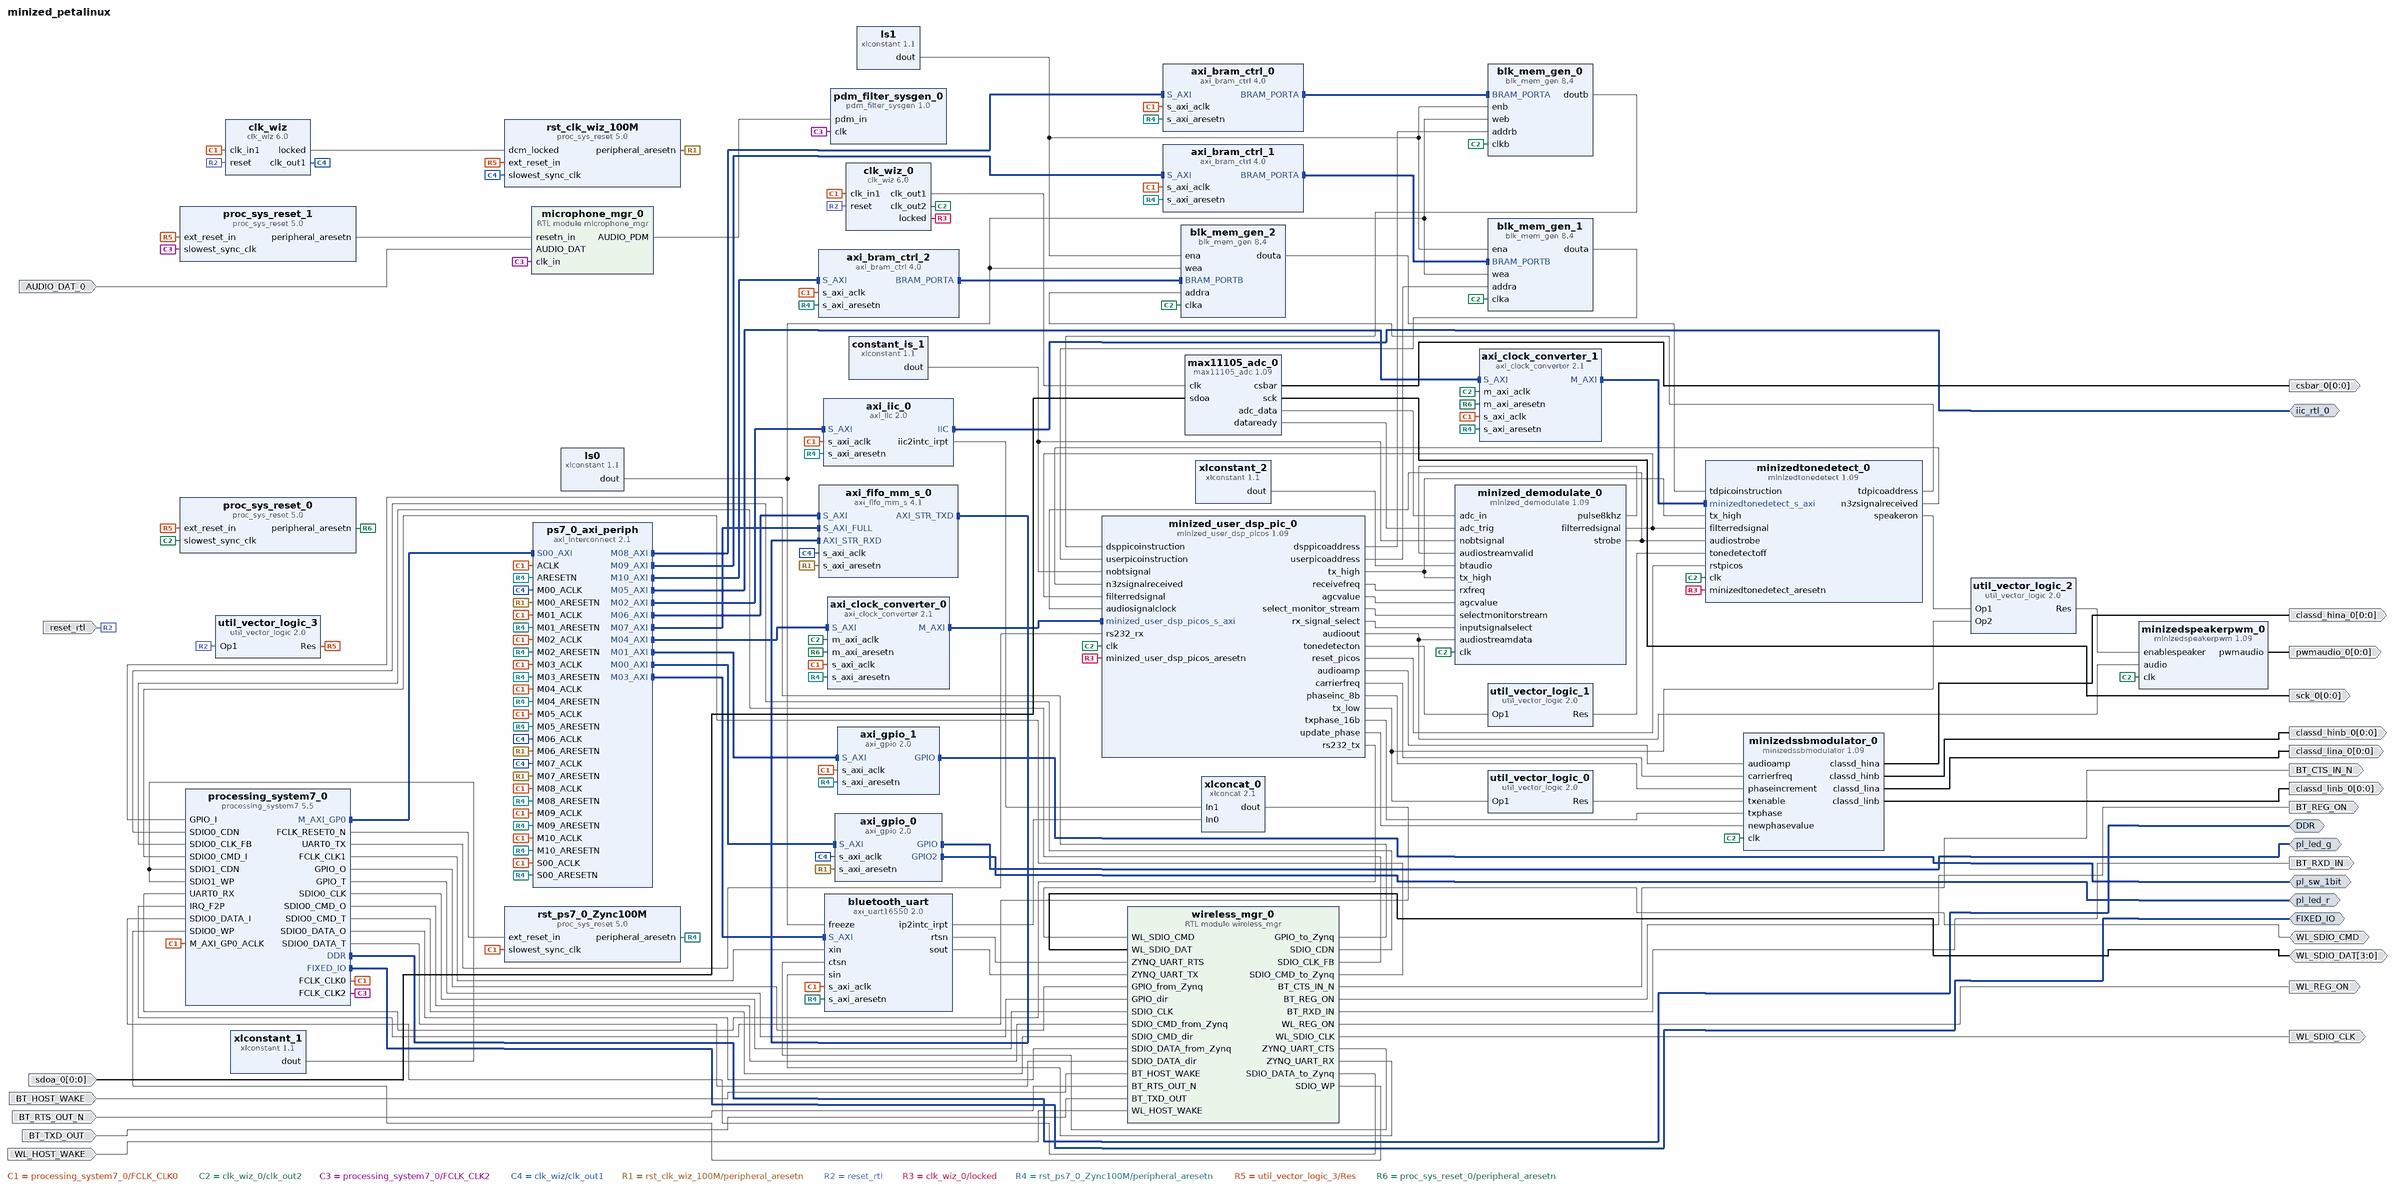
[diagram p0: block diagram of the top level]
# Vivado block design minized_petalinux, xc7z007sclg225-1, Vivado 2018.2.2
create_bd_design minized_petalinux

create_bd_intf_port -mode Master -vlnv xilinx.com:interface:ddrx_rtl:1.0 DDR
create_bd_intf_port -mode Master -vlnv xilinx.com:display_processing_system7:fixedio_rtl:1.0 FIXED_IO
create_bd_intf_port -mode Master -vlnv xilinx.com:interface:iic_rtl:1.0 iic_rtl_0
create_bd_intf_port -mode Master -vlnv xilinx.com:interface:gpio_rtl:1.0 pl_led_g
create_bd_intf_port -mode Master -vlnv xilinx.com:interface:gpio_rtl:1.0 pl_led_r
create_bd_intf_port -mode Master -vlnv xilinx.com:interface:gpio_rtl:1.0 pl_sw_1bit
create_bd_port -dir I BT_HOST_WAKE
create_bd_port -dir I BT_RTS_OUT_N
create_bd_port -dir I BT_TXD_OUT
create_bd_port -dir IO WL_SDIO_CMD
create_bd_port -dir IO -from 3 -to 0 WL_SDIO_DAT
create_bd_port -dir I WL_HOST_WAKE
create_bd_port -dir O BT_CTS_IN_N
create_bd_port -dir O BT_REG_ON
create_bd_port -dir O BT_RXD_IN
create_bd_port -dir O WL_REG_ON
create_bd_port -dir O -type clk WL_SDIO_CLK
create_bd_port -dir I -from 0 -to 0 -type data sdoa_0
set_property -dict [list \
  CONFIG.LAYERED_METADATA {xilinx.com:interface:datatypes:1.0 {DATA {datatype {name {attribs {resolve_type immediate dependency {} format string minimum {} maximum {}} value {}} bitwidth {attribs {resolve_type immediate dependency {} format long minimum {} maximum {}} value 1} bitoffset {attribs {resolve_type immediate dependency {} format long minimum {} maximum {}} value 0} real {fixed {fractwidth {attribs {resolve_type immediate dependency {} format long minimum {} maximum {}} value 0} signed {attribs {resolve_type immediate dependency {} format bool minimum {} maximum {}} value false}}}}}}} \
] [get_bd_ports sdoa_0]
create_bd_port -dir O -from 0 -to 0 -type data csbar_0
create_bd_port -dir O -from 0 -to 0 -type data sck_0
create_bd_port -dir O -from 0 -to 0 -type data pwmaudio_0
create_bd_port -dir O -from 0 -to 0 -type data classd_hina_0
create_bd_port -dir O -from 0 -to 0 -type data classd_lina_0
create_bd_port -dir O -from 0 -to 0 -type data classd_hinb_0
create_bd_port -dir O -from 0 -to 0 -type data classd_linb_0
create_bd_port -dir I AUDIO_DAT_0
create_bd_port -dir I -type rst reset_rtl
set_property -dict {CONFIG.POLARITY ACTIVE_HIGH} [get_bd_ports reset_rtl]

create_bd_cell -type ip -vlnv xilinx.com:ip:axi_gpio:2.0 axi_gpio_0
set_property -dict [list \
  CONFIG.C_GPIO_WIDTH 1 \
  CONFIG.C_GPIO2_WIDTH 1 \
  CONFIG.C_IS_DUAL 1 \
  CONFIG.C_ALL_INPUTS_2 0 \
  CONFIG.USE_BOARD_FLOW true \
  CONFIG.GPIO_BOARD_INTERFACE Custom \
  CONFIG.C_ALL_OUTPUTS 1 \
  CONFIG.C_ALL_OUTPUTS_2 1 \
] [get_bd_cells axi_gpio_0]
create_bd_cell -type ip -vlnv xilinx.com:ip:axi_gpio:2.0 axi_gpio_1
set_property -dict {CONFIG.USE_BOARD_FLOW true CONFIG.GPIO_BOARD_INTERFACE pl_sw_1bit} [get_bd_cells axi_gpio_1]
create_bd_cell -type ip -vlnv xilinx.com:ip:axi_iic:2.0 axi_iic_0
create_bd_cell -type ip -vlnv xilinx.com:ip:axi_uart16550:2.0 bluetooth_uart
set_property -dict [list \
  CONFIG.C_EXTERNAL_XIN_CLK_HZ 48000000 \
  CONFIG.C_EXTERNAL_XIN_CLK_HZ_d 48 \
  CONFIG.C_HAS_EXTERNAL_XIN 1 \
] [get_bd_cells bluetooth_uart]
create_bd_cell -type ip -vlnv xilinx.com:ip:processing_system7:5.5 processing_system7_0
set_property -dict [list \
  CONFIG.PCW_FCLK_CLK1_BUF TRUE \
  CONFIG.PCW_FCLK_CLK2_BUF TRUE \
  CONFIG.PCW_UIPARAM_DDR_FREQ_MHZ 533.333333 \
  CONFIG.PCW_APU_PERIPHERAL_FREQMHZ 666.666666 \
  CONFIG.PCW_QSPI_PERIPHERAL_FREQMHZ 120 \
  CONFIG.PCW_SDIO_PERIPHERAL_FREQMHZ 25 \
  CONFIG.PCW_UART_PERIPHERAL_FREQMHZ 100 \
  CONFIG.PCW_FPGA0_PERIPHERAL_FREQMHZ 100 \
  CONFIG.PCW_FPGA1_PERIPHERAL_FREQMHZ 48 \
  CONFIG.PCW_FPGA2_PERIPHERAL_FREQMHZ 160 \
  CONFIG.PCW_USE_FABRIC_INTERRUPT 1 \
  CONFIG.PCW_GPIO_EMIO_GPIO_WIDTH 4 \
  CONFIG.PCW_DQ_WIDTH 16 \
  CONFIG.PCW_DQS_WIDTH 2 \
  CONFIG.PCW_DM_WIDTH 2 \
  CONFIG.PCW_MIO_PRIMITIVE 32 \
  CONFIG.PCW_EN_CLK1_PORT 1 \
  CONFIG.PCW_EN_CLK2_PORT 1 \
  CONFIG.PCW_IRQ_F2P_INTR 1 \
  CONFIG.PCW_PRESET_BANK1_VOLTAGE {LVCMOS 3.3V} \
  CONFIG.PCW_UIPARAM_DDR_MEMORY_TYPE {DDR 3 (Low Voltage)} \
  CONFIG.PCW_UIPARAM_DDR_BUS_WIDTH {16 Bit} \
  CONFIG.PCW_UIPARAM_DDR_PARTNO {MT41K256M16 RE-125} \
  CONFIG.PCW_QSPI_PERIPHERAL_ENABLE 1 \
  CONFIG.PCW_QSPI_QSPI_IO {MIO 1 .. 6} \
  CONFIG.PCW_QSPI_GRP_SINGLE_SS_ENABLE 1 \
  CONFIG.PCW_QSPI_GRP_SINGLE_SS_IO {MIO 1 .. 6} \
  CONFIG.PCW_SINGLE_QSPI_DATA_MODE x4 \
  CONFIG.PCW_QSPI_GRP_FBCLK_ENABLE 1 \
  CONFIG.PCW_QSPI_GRP_FBCLK_IO {MIO 8} \
  CONFIG.PCW_ENET0_PERIPHERAL_ENABLE 0 \
  CONFIG.PCW_SD0_PERIPHERAL_ENABLE 1 \
  CONFIG.PCW_SD0_SD0_IO EMIO \
  CONFIG.PCW_SD1_PERIPHERAL_ENABLE 1 \
  CONFIG.PCW_SD1_SD1_IO {MIO 10 .. 15} \
  CONFIG.PCW_SD1_GRP_CD_ENABLE 1 \
  CONFIG.PCW_SD1_GRP_CD_IO EMIO \
  CONFIG.PCW_SD1_GRP_WP_ENABLE 1 \
  CONFIG.PCW_SD1_GRP_WP_IO EMIO \
  CONFIG.PCW_UART0_PERIPHERAL_ENABLE 1 \
  CONFIG.PCW_UART0_UART0_IO EMIO \
  CONFIG.PCW_UART0_GRP_FULL_ENABLE 1 \
  CONFIG.PCW_UART0_GRP_FULL_IO EMIO \
  CONFIG.PCW_UART1_PERIPHERAL_ENABLE 1 \
  CONFIG.PCW_UART1_UART1_IO {MIO 48 .. 49} \
  CONFIG.PCW_USB0_PERIPHERAL_ENABLE 1 \
  CONFIG.PCW_USB0_USB0_IO {MIO 28 .. 39} \
  CONFIG.PCW_USB_RESET_ENABLE 1 \
  CONFIG.PCW_USB_RESET_SELECT {Share reset pin} \
  CONFIG.PCW_USB0_RESET_ENABLE 1 \
  CONFIG.PCW_USB0_RESET_IO {MIO 7} \
  CONFIG.PCW_I2C_RESET_ENABLE 1 \
  CONFIG.PCW_GPIO_MIO_GPIO_ENABLE 1 \
  CONFIG.PCW_GPIO_MIO_GPIO_IO MIO \
  CONFIG.PCW_GPIO_EMIO_GPIO_ENABLE 1 \
  CONFIG.PCW_GPIO_EMIO_GPIO_IO 4 \
  CONFIG.PCW_FPGA_FCLK1_ENABLE 1 \
  CONFIG.PCW_FPGA_FCLK2_ENABLE 1 \
] [get_bd_cells processing_system7_0]
# 314 more settings of processing_system7_0 are not shown: defaults, MIO pin electricals, DDR timing, and values the tool derives
create_bd_cell -type ip -vlnv xilinx.com:ip:axi_interconnect:2.1 ps7_0_axi_periph
set_property -dict {CONFIG.NUM_MI 11} [get_bd_cells ps7_0_axi_periph]
create_bd_cell -type ip -vlnv xilinx.com:ip:xlconcat:2.1 xlconcat_0
set_property -dict {CONFIG.NUM_PORTS 2} [get_bd_cells xlconcat_0]
create_bd_cell -type ip -vlnv xilinx.com:ip:xlconstant:1.1 xlconstant_1
set_property -dict {CONFIG.CONST_VAL 0} [get_bd_cells xlconstant_1]
create_bd_cell -type module -reference wireless_mgr wireless_mgr_0
create_bd_cell -type ip -vlnv AssociationNicola:SysGen:minized_demodulate:1.09 minized_demodulate_0
create_bd_cell -type ip -vlnv AssociationNicola:SysGen:minizedspeakerpwm:1.09 minizedspeakerpwm_0
create_bd_cell -type ip -vlnv AssociationNicola:SysGen:minizedssbmodulator:1.09 minizedssbmodulator_0
create_bd_cell -type ip -vlnv AssociationNicola:SysGen:minizedtonedetect:1.09 minizedtonedetect_0
create_bd_cell -type ip -vlnv xilinx.com:ip:util_vector_logic:2.0 util_vector_logic_0
set_property -dict {CONFIG.C_SIZE 1 CONFIG.C_OPERATION not} [get_bd_cells util_vector_logic_0]
create_bd_cell -type ip -vlnv xilinx.com:ip:clk_wiz:6.0 clk_wiz_0
set_property -dict [list \
  CONFIG.PRIM_IN_FREQ 100 \
  CONFIG.CLKIN1_JITTER_PS 100.0 \
  CONFIG.CLKOUT2_USED true \
  CONFIG.CLKOUT3_USED false \
  CONFIG.NUM_OUT_CLKS 2 \
  CONFIG.CLKOUT1_REQUESTED_OUT_FREQ 131.072 \
  CONFIG.CLKOUT2_REQUESTED_OUT_FREQ 65.536 \
  CONFIG.MMCM_DIVCLK_DIVIDE 6 \
  CONFIG.MMCM_CLKFBOUT_MULT_F 51.125 \
  CONFIG.MMCM_CLKIN1_PERIOD 10.000 \
  CONFIG.MMCM_CLKIN2_PERIOD 10.000 \
  CONFIG.MMCM_CLKOUT0_DIVIDE_F 6.500 \
  CONFIG.MMCM_CLKOUT1_DIVIDE 13 \
  CONFIG.MMCM_CLKOUT2_DIVIDE 1 \
  CONFIG.CLKOUT1_JITTER 303.243 \
  CONFIG.CLKOUT1_PHASE_ERROR 386.312 \
  CONFIG.CLKOUT2_JITTER 334.225 \
  CONFIG.CLKOUT2_PHASE_ERROR 386.312 \
  CONFIG.CLKOUT3_JITTER 259.942 \
  CONFIG.CLKOUT3_PHASE_ERROR 297.965 \
] [get_bd_cells clk_wiz_0]
create_bd_cell -type ip -vlnv xilinx.com:ip:xlconstant:1.1 constant_is_1
create_bd_cell -type ip -vlnv xilinx.com:ip:xlconstant:1.1 xlconstant_2
set_property -dict {CONFIG.CONST_WIDTH 16 CONFIG.CONST_VAL 0} [get_bd_cells xlconstant_2]
create_bd_cell -type ip -vlnv xilinx.com:ip:util_vector_logic:2.0 util_vector_logic_1
set_property -dict {CONFIG.C_SIZE 1 CONFIG.C_OPERATION not} [get_bd_cells util_vector_logic_1]
create_bd_cell -type ip -vlnv xilinx.com:ip:util_vector_logic:2.0 util_vector_logic_2
set_property -dict {CONFIG.C_SIZE 1 CONFIG.C_OPERATION and} [get_bd_cells util_vector_logic_2]
create_bd_cell -type ip -vlnv AssociationNicola:SysGen:minized_user_dsp_picos:1.09 minized_user_dsp_pic_0
create_bd_cell -type ip -vlnv AssociationNicola:SysGen:max11105_adc:1.09 max11105_adc_0
create_bd_cell -type module -reference microphone_mgr microphone_mgr_0
create_bd_cell -type ip -vlnv Avnet_Inc:SysGen:pdm_filter_sysgen:1.0 pdm_filter_sysgen_0
create_bd_cell -type ip -vlnv xilinx.com:ip:axi_fifo_mm_s:4.1 axi_fifo_mm_s_0
set_property -dict {CONFIG.C_DATA_INTERFACE_TYPE 1 CONFIG.C_USE_TX_CTRL 0} [get_bd_cells axi_fifo_mm_s_0]
create_bd_cell -type ip -vlnv xilinx.com:ip:axi_bram_ctrl:4.0 axi_bram_ctrl_0
set_property -dict {CONFIG.SINGLE_PORT_BRAM 1} [get_bd_cells axi_bram_ctrl_0]
create_bd_cell -type ip -vlnv xilinx.com:ip:blk_mem_gen:8.4 blk_mem_gen_0
set_property -dict [list \
  CONFIG.Memory_Type True_Dual_Port_RAM \
  CONFIG.Enable_32bit_Address false \
  CONFIG.Use_Byte_Write_Enable false \
  CONFIG.Write_Depth_A 2048 \
  CONFIG.Enable_B Use_ENB_Pin \
  CONFIG.Register_PortA_Output_of_Memory_Primitives true \
  CONFIG.Register_PortB_Output_of_Memory_Primitives true \
  CONFIG.Load_Init_File false \
  CONFIG.Use_RSTA_Pin false \
  CONFIG.Use_RSTB_Pin false \
  CONFIG.Port_B_Clock 100 \
  CONFIG.Port_B_Write_Rate 50 \
  CONFIG.Port_B_Enable_Rate 100 \
  CONFIG.use_bram_block Stand_Alone \
] [get_bd_cells blk_mem_gen_0]
create_bd_cell -type ip -vlnv xilinx.com:ip:clk_wiz:6.0 clk_wiz
set_property -dict [list \
  CONFIG.PRIM_IN_FREQ 100 \
  CONFIG.CLKIN1_JITTER_PS 100.0 \
  CONFIG.MMCM_DIVCLK_DIVIDE 1 \
  CONFIG.MMCM_CLKFBOUT_MULT_F 10.000 \
  CONFIG.MMCM_CLKIN1_PERIOD 10.000 \
  CONFIG.MMCM_CLKIN2_PERIOD 10.000 \
  CONFIG.CLKOUT1_JITTER 130.958 \
  CONFIG.CLKOUT1_PHASE_ERROR 98.575 \
] [get_bd_cells clk_wiz]
create_bd_cell -type ip -vlnv xilinx.com:ip:proc_sys_reset:5.0 rst_clk_wiz_100M
create_bd_cell -type ip -vlnv xilinx.com:ip:proc_sys_reset:5.0 rst_ps7_0_Zync100M
create_bd_cell -type ip -vlnv xilinx.com:ip:axi_bram_ctrl:4.0 axi_bram_ctrl_1
set_property -dict {CONFIG.SINGLE_PORT_BRAM 1} [get_bd_cells axi_bram_ctrl_1]
create_bd_cell -type ip -vlnv xilinx.com:ip:axi_bram_ctrl:4.0 axi_bram_ctrl_2
set_property -dict {CONFIG.SINGLE_PORT_BRAM 1} [get_bd_cells axi_bram_ctrl_2]
create_bd_cell -type ip -vlnv xilinx.com:ip:xlconstant:1.1 Is1
create_bd_cell -type ip -vlnv xilinx.com:ip:xlconstant:1.1 Is0
set_property -dict {CONFIG.CONST_VAL 0} [get_bd_cells Is0]
create_bd_cell -type ip -vlnv xilinx.com:ip:blk_mem_gen:8.4 blk_mem_gen_1
set_property -dict [list \
  CONFIG.Memory_Type True_Dual_Port_RAM \
  CONFIG.Enable_32bit_Address false \
  CONFIG.Use_Byte_Write_Enable false \
  CONFIG.Write_Depth_A 2048 \
  CONFIG.Enable_B Use_ENB_Pin \
  CONFIG.Register_PortA_Output_of_Memory_Primitives true \
  CONFIG.Register_PortB_Output_of_Memory_Primitives true \
  CONFIG.Load_Init_File false \
  CONFIG.Use_RSTA_Pin false \
  CONFIG.Use_RSTB_Pin false \
  CONFIG.Port_B_Clock 100 \
  CONFIG.Port_B_Write_Rate 50 \
  CONFIG.Port_B_Enable_Rate 100 \
  CONFIG.use_bram_block Stand_Alone \
] [get_bd_cells blk_mem_gen_1]
create_bd_cell -type ip -vlnv xilinx.com:ip:blk_mem_gen:8.4 blk_mem_gen_2
set_property -dict [list \
  CONFIG.Memory_Type True_Dual_Port_RAM \
  CONFIG.Enable_32bit_Address false \
  CONFIG.Use_Byte_Write_Enable false \
  CONFIG.Write_Depth_A 2048 \
  CONFIG.Enable_B Use_ENB_Pin \
  CONFIG.Register_PortA_Output_of_Memory_Primitives true \
  CONFIG.Register_PortB_Output_of_Memory_Primitives true \
  CONFIG.Load_Init_File false \
  CONFIG.Use_RSTA_Pin false \
  CONFIG.Use_RSTB_Pin false \
  CONFIG.Port_B_Clock 100 \
  CONFIG.Port_B_Write_Rate 50 \
  CONFIG.Port_B_Enable_Rate 100 \
  CONFIG.use_bram_block Stand_Alone \
] [get_bd_cells blk_mem_gen_2]
create_bd_cell -type ip -vlnv xilinx.com:ip:axi_clock_converter:2.1 axi_clock_converter_0
create_bd_cell -type ip -vlnv xilinx.com:ip:axi_clock_converter:2.1 axi_clock_converter_1
create_bd_cell -type ip -vlnv xilinx.com:ip:proc_sys_reset:5.0 proc_sys_reset_1
create_bd_cell -type ip -vlnv xilinx.com:ip:util_vector_logic:2.0 util_vector_logic_3
set_property -dict {CONFIG.C_SIZE 1 CONFIG.C_OPERATION not} [get_bd_cells util_vector_logic_3]
create_bd_cell -type ip -vlnv xilinx.com:ip:proc_sys_reset:5.0 proc_sys_reset_0

# ---- connections ----

connect_bd_intf_net [get_bd_intf_pins processing_system7_0/M_AXI_GP0] [get_bd_intf_pins ps7_0_axi_periph/S00_AXI]
connect_bd_intf_net [get_bd_intf_pins axi_gpio_0/S_AXI] [get_bd_intf_pins ps7_0_axi_periph/M00_AXI]
connect_bd_intf_net [get_bd_intf_pins axi_gpio_1/S_AXI] [get_bd_intf_pins ps7_0_axi_periph/M01_AXI]
connect_bd_intf_net [get_bd_intf_pins axi_iic_0/S_AXI] [get_bd_intf_pins ps7_0_axi_periph/M02_AXI]
connect_bd_intf_net [get_bd_intf_pins bluetooth_uart/S_AXI] [get_bd_intf_pins ps7_0_axi_periph/M03_AXI]
connect_bd_intf_net [get_bd_intf_pins axi_fifo_mm_s_0/AXI_STR_TXD] [get_bd_intf_pins axi_fifo_mm_s_0/AXI_STR_RXD]
connect_bd_intf_net [get_bd_intf_pins ps7_0_axi_periph/M06_AXI] [get_bd_intf_pins axi_fifo_mm_s_0/S_AXI]
connect_bd_intf_net [get_bd_intf_pins ps7_0_axi_periph/M07_AXI] [get_bd_intf_pins axi_fifo_mm_s_0/S_AXI_FULL]
connect_bd_intf_net [get_bd_intf_pins ps7_0_axi_periph/M08_AXI] [get_bd_intf_pins axi_bram_ctrl_0/S_AXI]
connect_bd_intf_net [get_bd_intf_pins axi_bram_ctrl_1/BRAM_PORTA] [get_bd_intf_pins blk_mem_gen_1/BRAM_PORTB]
connect_bd_intf_net [get_bd_intf_pins axi_bram_ctrl_2/BRAM_PORTA] [get_bd_intf_pins blk_mem_gen_2/BRAM_PORTB]
connect_bd_intf_net [get_bd_intf_pins ps7_0_axi_periph/M09_AXI] [get_bd_intf_pins axi_bram_ctrl_1/S_AXI]
connect_bd_intf_net [get_bd_intf_pins ps7_0_axi_periph/M10_AXI] [get_bd_intf_pins axi_bram_ctrl_2/S_AXI]
connect_bd_intf_net [get_bd_intf_pins ps7_0_axi_periph/M04_AXI] [get_bd_intf_pins axi_clock_converter_0/S_AXI]
connect_bd_intf_net [get_bd_intf_pins axi_clock_converter_0/M_AXI] [get_bd_intf_pins minized_user_dsp_pic_0/minized_user_dsp_picos_s_axi]
connect_bd_intf_net [get_bd_intf_pins ps7_0_axi_periph/M05_AXI] [get_bd_intf_pins axi_clock_converter_1/S_AXI]
connect_bd_intf_net [get_bd_intf_pins axi_clock_converter_1/M_AXI] [get_bd_intf_pins minizedtonedetect_0/minizedtonedetect_s_axi]
connect_bd_intf_net [get_bd_intf_pins blk_mem_gen_0/BRAM_PORTA] [get_bd_intf_pins axi_bram_ctrl_0/BRAM_PORTA]
connect_bd_intf_net [get_bd_intf_ports DDR] [get_bd_intf_pins processing_system7_0/DDR]
connect_bd_intf_net [get_bd_intf_ports FIXED_IO] [get_bd_intf_pins processing_system7_0/FIXED_IO]
connect_bd_intf_net [get_bd_intf_ports iic_rtl_0] [get_bd_intf_pins axi_iic_0/IIC]
connect_bd_intf_net [get_bd_intf_ports pl_led_g] [get_bd_intf_pins axi_gpio_0/GPIO]
connect_bd_intf_net [get_bd_intf_ports pl_led_r] [get_bd_intf_pins axi_gpio_0/GPIO2]
connect_bd_intf_net [get_bd_intf_ports pl_sw_1bit] [get_bd_intf_pins axi_gpio_1/GPIO]
connect_bd_net [get_bd_ports BT_HOST_WAKE] [get_bd_pins wireless_mgr_0/BT_HOST_WAKE]
connect_bd_net [get_bd_ports BT_RTS_OUT_N] [get_bd_pins wireless_mgr_0/BT_RTS_OUT_N]
connect_bd_net [get_bd_ports BT_TXD_OUT] [get_bd_pins wireless_mgr_0/BT_TXD_OUT]
connect_bd_net [get_bd_ports WL_SDIO_CMD] [get_bd_pins wireless_mgr_0/WL_SDIO_CMD]
connect_bd_net [get_bd_ports WL_SDIO_DAT] [get_bd_pins wireless_mgr_0/WL_SDIO_DAT]
connect_bd_net [get_bd_ports WL_HOST_WAKE] [get_bd_pins wireless_mgr_0/WL_HOST_WAKE]
connect_bd_net [get_bd_pins axi_iic_0/iic2intc_irpt] [get_bd_pins xlconcat_0/In1]
connect_bd_net -net bluetooth_uart_INT [get_bd_pins bluetooth_uart/ip2intc_irpt] [get_bd_pins xlconcat_0/In0]
connect_bd_net [get_bd_pins processing_system7_0/FCLK_CLK1] [get_bd_pins bluetooth_uart/xin]
connect_bd_net [get_bd_pins processing_system7_0/FCLK_RESET0_N] [get_bd_pins rst_ps7_0_Zync100M/ext_reset_in]
connect_bd_net [get_bd_pins processing_system7_0/GPIO_O] [get_bd_pins wireless_mgr_0/GPIO_from_Zynq]
connect_bd_net [get_bd_pins processing_system7_0/GPIO_T] [get_bd_pins wireless_mgr_0/GPIO_dir]
connect_bd_net [get_bd_pins processing_system7_0/SDIO0_CLK] [get_bd_pins wireless_mgr_0/SDIO_CLK]
connect_bd_net [get_bd_pins processing_system7_0/SDIO0_CMD_O] [get_bd_pins wireless_mgr_0/SDIO_CMD_from_Zynq]
connect_bd_net [get_bd_pins processing_system7_0/SDIO0_CMD_T] [get_bd_pins wireless_mgr_0/SDIO_CMD_dir]
connect_bd_net [get_bd_pins processing_system7_0/SDIO0_DATA_O] [get_bd_pins wireless_mgr_0/SDIO_DATA_from_Zynq]
connect_bd_net [get_bd_pins processing_system7_0/SDIO0_DATA_T] [get_bd_pins wireless_mgr_0/SDIO_DATA_dir]
connect_bd_net [get_bd_pins wireless_mgr_0/BT_CTS_IN_N] [get_bd_ports BT_CTS_IN_N]
connect_bd_net [get_bd_pins wireless_mgr_0/BT_REG_ON] [get_bd_ports BT_REG_ON]
connect_bd_net [get_bd_pins wireless_mgr_0/BT_RXD_IN] [get_bd_ports BT_RXD_IN]
connect_bd_net [get_bd_pins wireless_mgr_0/GPIO_to_Zynq] [get_bd_pins processing_system7_0/GPIO_I]
connect_bd_net [get_bd_pins wireless_mgr_0/SDIO_CDN] [get_bd_pins processing_system7_0/SDIO0_CDN]
connect_bd_net [get_bd_pins wireless_mgr_0/SDIO_CLK_FB] [get_bd_pins processing_system7_0/SDIO0_CLK_FB]
connect_bd_net [get_bd_pins wireless_mgr_0/SDIO_CMD_to_Zynq] [get_bd_pins processing_system7_0/SDIO0_CMD_I]
connect_bd_net [get_bd_pins wireless_mgr_0/SDIO_DATA_to_Zynq] [get_bd_pins processing_system7_0/SDIO0_DATA_I]
connect_bd_net [get_bd_pins wireless_mgr_0/SDIO_WP] [get_bd_pins processing_system7_0/SDIO0_WP]
connect_bd_net -net wireless_mgr_0_UART_CTS [get_bd_pins wireless_mgr_0/ZYNQ_UART_CTS] [get_bd_pins bluetooth_uart/ctsn]
connect_bd_net -net wireless_mgr_0_UART_RTS [get_bd_pins bluetooth_uart/rtsn] [get_bd_pins wireless_mgr_0/ZYNQ_UART_RTS]
connect_bd_net -net wireless_mgr_0_UART_RX [get_bd_pins wireless_mgr_0/ZYNQ_UART_RX] [get_bd_pins bluetooth_uart/sin]
connect_bd_net -net wireless_mgr_0_UART_TX [get_bd_pins bluetooth_uart/sout] [get_bd_pins wireless_mgr_0/ZYNQ_UART_TX]
connect_bd_net [get_bd_pins wireless_mgr_0/WL_REG_ON] [get_bd_ports WL_REG_ON]
connect_bd_net [get_bd_pins wireless_mgr_0/WL_SDIO_CLK] [get_bd_ports WL_SDIO_CLK]
connect_bd_net [get_bd_pins xlconcat_0/dout] [get_bd_pins processing_system7_0/IRQ_F2P]
connect_bd_net [get_bd_pins xlconstant_1/dout] [get_bd_pins processing_system7_0/SDIO1_CDN] [get_bd_pins processing_system7_0/SDIO1_WP]
connect_bd_net [get_bd_pins processing_system7_0/UART0_TX] [get_bd_pins minized_user_dsp_pic_0/rs232_rx]
connect_bd_net [get_bd_pins minized_user_dsp_pic_0/rs232_tx] [get_bd_pins processing_system7_0/UART0_RX]
connect_bd_net [get_bd_pins minized_user_dsp_pic_0/audioamp] [get_bd_pins minizedssbmodulator_0/audioamp]
connect_bd_net [get_bd_pins minized_user_dsp_pic_0/carrierfreq] [get_bd_pins minizedssbmodulator_0/carrierfreq]
connect_bd_net [get_bd_pins minized_user_dsp_pic_0/phaseinc_8b] [get_bd_pins minizedssbmodulator_0/phaseincrement]
connect_bd_net [get_bd_pins minized_user_dsp_pic_0/txphase_16b] [get_bd_pins minizedssbmodulator_0/txphase]
connect_bd_net [get_bd_pins minized_user_dsp_pic_0/update_phase] [get_bd_pins minizedssbmodulator_0/newphasevalue]
connect_bd_net [get_bd_pins minized_user_dsp_pic_0/audioout] \
  [get_bd_pins minizedspeakerpwm_0/audio] [get_bd_pins minized_demodulate_0/audiostreamdata]
connect_bd_net [get_bd_pins minized_user_dsp_pic_0/tx_low] [get_bd_pins util_vector_logic_0/Op1] [get_bd_pins util_vector_logic_2/Op2]
connect_bd_net [get_bd_pins util_vector_logic_0/Res] [get_bd_pins minizedssbmodulator_0/txenable]
connect_bd_net [get_bd_pins minized_user_dsp_pic_0/receivefreq] [get_bd_pins minized_demodulate_0/rxfreq]
connect_bd_net [get_bd_pins minized_demodulate_0/filterredsignal] \
  [get_bd_pins minizedtonedetect_0/filterredsignal] [get_bd_pins minized_user_dsp_pic_0/filterredsignal]
connect_bd_net [get_bd_pins minized_user_dsp_pic_0/agcvalue] [get_bd_pins minized_demodulate_0/agcvalue]
connect_bd_net [get_bd_pins processing_system7_0/FCLK_CLK0] \
  [get_bd_pins clk_wiz_0/clk_in1] [get_bd_pins axi_iic_0/s_axi_aclk] [get_bd_pins axi_bram_ctrl_0/s_axi_aclk] \
  [get_bd_pins rst_ps7_0_Zync100M/slowest_sync_clk] [get_bd_pins clk_wiz/clk_in1] [get_bd_pins axi_bram_ctrl_1/s_axi_aclk] \
  [get_bd_pins axi_bram_ctrl_2/s_axi_aclk] [get_bd_pins axi_clock_converter_0/s_axi_aclk] \
  [get_bd_pins axi_clock_converter_1/s_axi_aclk] [get_bd_pins processing_system7_0/M_AXI_GP0_ACLK] \
  [get_bd_pins axi_gpio_1/s_axi_aclk] [get_bd_pins bluetooth_uart/s_axi_aclk] [get_bd_pins ps7_0_axi_periph/M02_ACLK] \
  [get_bd_pins ps7_0_axi_periph/ACLK] [get_bd_pins ps7_0_axi_periph/M04_ACLK] [get_bd_pins ps7_0_axi_periph/M05_ACLK] \
  [get_bd_pins ps7_0_axi_periph/M08_ACLK] [get_bd_pins ps7_0_axi_periph/M09_ACLK] [get_bd_pins ps7_0_axi_periph/M10_ACLK] \
  [get_bd_pins ps7_0_axi_periph/M01_ACLK] [get_bd_pins ps7_0_axi_periph/M03_ACLK] [get_bd_pins ps7_0_axi_periph/S00_ACLK]
connect_bd_net [get_bd_pins minized_demodulate_0/pulse8khz] [get_bd_pins minized_demodulate_0/audiostreamvalid]
connect_bd_net [get_bd_pins minized_demodulate_0/strobe] \
  [get_bd_pins minizedtonedetect_0/audiostrobe] [get_bd_pins minized_user_dsp_pic_0/audiosignalclock]
connect_bd_net [get_bd_pins xlconstant_2/dout] [get_bd_pins minized_demodulate_0/btaudio]
connect_bd_net -net xlconstant_0_dout [get_bd_pins constant_is_1/dout] \
  [get_bd_pins minized_demodulate_0/nobtsignal] [get_bd_pins minized_user_dsp_pic_0/nobtsignal]
connect_bd_net [get_bd_pins minized_user_dsp_pic_0/tx_high] [get_bd_pins minized_demodulate_0/tx_high] [get_bd_pins minizedtonedetect_0/tx_high]
connect_bd_net [get_bd_pins minized_user_dsp_pic_0/select_monitor_stream] [get_bd_pins minized_demodulate_0/selectmonitorstream]
connect_bd_net [get_bd_pins minized_user_dsp_pic_0/rx_signal_select] [get_bd_pins minized_demodulate_0/inputsignalselect]
connect_bd_net [get_bd_pins minized_user_dsp_pic_0/tonedetecton] [get_bd_pins util_vector_logic_1/Op1]
connect_bd_net [get_bd_pins util_vector_logic_1/Res] [get_bd_pins minizedtonedetect_0/tonedetectoff]
connect_bd_net [get_bd_pins minized_user_dsp_pic_0/reset_picos] [get_bd_pins minizedtonedetect_0/rstpicos]
connect_bd_net [get_bd_pins minizedtonedetect_0/speakeron] [get_bd_pins util_vector_logic_2/Op1]
connect_bd_net [get_bd_pins util_vector_logic_2/Res] [get_bd_pins minizedspeakerpwm_0/enablespeaker]
connect_bd_net [get_bd_pins minizedtonedetect_0/n3zsignalreceived] [get_bd_pins minized_user_dsp_pic_0/n3zsignalreceived]
connect_bd_net [get_bd_pins clk_wiz_0/clk_out1] [get_bd_pins max11105_adc_0/clk]
connect_bd_net -net max11105_adc_0_sysgenclk [get_bd_pins clk_wiz_0/clk_out2] \
  [get_bd_pins minized_demodulate_0/clk] [get_bd_pins minized_user_dsp_pic_0/clk] [get_bd_pins minizedssbmodulator_0/clk] \
  [get_bd_pins minizedspeakerpwm_0/clk] [get_bd_pins minizedtonedetect_0/clk] [get_bd_pins blk_mem_gen_1/clka] \
  [get_bd_pins blk_mem_gen_2/clka] [get_bd_pins axi_clock_converter_0/m_axi_aclk] \
  [get_bd_pins axi_clock_converter_1/m_axi_aclk] [get_bd_pins blk_mem_gen_0/clkb] \
  [get_bd_pins proc_sys_reset_0/slowest_sync_clk]
connect_bd_net -net sdoa_0_1 [get_bd_ports sdoa_0] [get_bd_pins max11105_adc_0/sdoa]
connect_bd_net [get_bd_pins max11105_adc_0/adc_data] [get_bd_pins minized_demodulate_0/adc_in]
connect_bd_net [get_bd_pins max11105_adc_0/dataready] [get_bd_pins minized_demodulate_0/adc_trig]
connect_bd_net [get_bd_pins max11105_adc_0/csbar] [get_bd_ports csbar_0]
connect_bd_net [get_bd_pins max11105_adc_0/sck] [get_bd_ports sck_0]
connect_bd_net [get_bd_pins minizedspeakerpwm_0/pwmaudio] [get_bd_ports pwmaudio_0]
connect_bd_net [get_bd_pins minizedssbmodulator_0/classd_hina] [get_bd_ports classd_hina_0]
connect_bd_net [get_bd_pins minizedssbmodulator_0/classd_lina] [get_bd_ports classd_lina_0]
connect_bd_net [get_bd_pins minizedssbmodulator_0/classd_hinb] [get_bd_ports classd_hinb_0]
connect_bd_net [get_bd_pins minizedssbmodulator_0/classd_linb] [get_bd_ports classd_linb_0]
connect_bd_net [get_bd_pins microphone_mgr_0/AUDIO_PDM] [get_bd_pins pdm_filter_sysgen_0/pdm_in]
connect_bd_net [get_bd_pins processing_system7_0/FCLK_CLK2] \
  [get_bd_pins microphone_mgr_0/clk_in] [get_bd_pins pdm_filter_sysgen_0/clk] [get_bd_pins proc_sys_reset_1/slowest_sync_clk]
connect_bd_net -net AUDIO_DAT_0_1 [get_bd_ports AUDIO_DAT_0] [get_bd_pins microphone_mgr_0/AUDIO_DAT]
connect_bd_net [get_bd_pins clk_wiz/clk_out1] \
  [get_bd_pins axi_gpio_0/s_axi_aclk] [get_bd_pins axi_fifo_mm_s_0/s_axi_aclk] \
  [get_bd_pins rst_clk_wiz_100M/slowest_sync_clk] [get_bd_pins ps7_0_axi_periph/M00_ACLK] \
  [get_bd_pins ps7_0_axi_periph/M06_ACLK] [get_bd_pins ps7_0_axi_periph/M07_ACLK]
connect_bd_net [get_bd_pins clk_wiz/locked] [get_bd_pins rst_clk_wiz_100M/dcm_locked]
connect_bd_net [get_bd_pins rst_clk_wiz_100M/peripheral_aresetn] \
  [get_bd_pins axi_fifo_mm_s_0/s_axi_aresetn] [get_bd_pins axi_gpio_0/s_axi_aresetn] \
  [get_bd_pins ps7_0_axi_periph/M06_ARESETN] [get_bd_pins ps7_0_axi_periph/M07_ARESETN] \
  [get_bd_pins ps7_0_axi_periph/M00_ARESETN]
connect_bd_net [get_bd_pins minized_user_dsp_pic_0/dsppicoaddress] [get_bd_pins blk_mem_gen_0/addrb]
connect_bd_net [get_bd_pins Is1/dout] [get_bd_pins blk_mem_gen_1/ena] [get_bd_pins blk_mem_gen_2/ena] [get_bd_pins blk_mem_gen_0/enb]
connect_bd_net [get_bd_pins Is0/dout] \
  [get_bd_pins blk_mem_gen_2/wea] [get_bd_pins blk_mem_gen_1/wea] [get_bd_pins blk_mem_gen_0/web] \
  [get_bd_pins bluetooth_uart/freeze]
connect_bd_net [get_bd_pins minized_user_dsp_pic_0/userpicoaddress] [get_bd_pins blk_mem_gen_1/addra]
connect_bd_net [get_bd_pins blk_mem_gen_1/douta] [get_bd_pins minized_user_dsp_pic_0/userpicoinstruction]
connect_bd_net [get_bd_pins minizedtonedetect_0/tdpicoaddress] [get_bd_pins blk_mem_gen_2/addra]
connect_bd_net [get_bd_pins blk_mem_gen_2/douta] [get_bd_pins minizedtonedetect_0/tdpicoinstruction]
connect_bd_net [get_bd_ports reset_rtl] [get_bd_pins clk_wiz/reset] [get_bd_pins util_vector_logic_3/Op1] [get_bd_pins clk_wiz_0/reset]
connect_bd_net [get_bd_pins blk_mem_gen_0/doutb] [get_bd_pins minized_user_dsp_pic_0/dsppicoinstruction]
connect_bd_net [get_bd_pins clk_wiz_0/locked] \
  [get_bd_pins minized_user_dsp_pic_0/minized_user_dsp_picos_aresetn] \
  [get_bd_pins minizedtonedetect_0/minizedtonedetect_aresetn]
connect_bd_net -net rst_ps7_0_33M_peripheral_aresetn [get_bd_pins rst_ps7_0_Zync100M/peripheral_aresetn] \
  [get_bd_pins axi_iic_0/s_axi_aresetn] [get_bd_pins axi_bram_ctrl_2/s_axi_aresetn] \
  [get_bd_pins axi_bram_ctrl_1/s_axi_aresetn] [get_bd_pins axi_bram_ctrl_0/s_axi_aresetn] \
  [get_bd_pins axi_clock_converter_0/s_axi_aresetn] [get_bd_pins ps7_0_axi_periph/ARESETN] \
  [get_bd_pins ps7_0_axi_periph/M02_ARESETN] [get_bd_pins ps7_0_axi_periph/M04_ARESETN] \
  [get_bd_pins ps7_0_axi_periph/M05_ARESETN] [get_bd_pins ps7_0_axi_periph/M08_ARESETN] \
  [get_bd_pins ps7_0_axi_periph/M09_ARESETN] [get_bd_pins ps7_0_axi_periph/M10_ARESETN] \
  [get_bd_pins ps7_0_axi_periph/S00_ARESETN] [get_bd_pins ps7_0_axi_periph/M01_ARESETN] \
  [get_bd_pins ps7_0_axi_periph/M03_ARESETN] [get_bd_pins axi_clock_converter_1/s_axi_aresetn] \
  [get_bd_pins bluetooth_uart/s_axi_aresetn] [get_bd_pins axi_gpio_1/s_axi_aresetn]
connect_bd_net [get_bd_pins proc_sys_reset_1/peripheral_aresetn] [get_bd_pins microphone_mgr_0/resetn_in]
connect_bd_net [get_bd_pins util_vector_logic_3/Res] \
  [get_bd_pins rst_clk_wiz_100M/ext_reset_in] [get_bd_pins proc_sys_reset_0/ext_reset_in] \
  [get_bd_pins proc_sys_reset_1/ext_reset_in]
connect_bd_net [get_bd_pins proc_sys_reset_0/peripheral_aresetn] \
  [get_bd_pins axi_clock_converter_1/m_axi_aresetn] [get_bd_pins axi_clock_converter_0/m_axi_aresetn]

# ---- address map ----
assign_bd_address -offset 0x40000000 -range 8K -target_address_space [get_bd_addr_spaces processing_system7_0/Data] [get_bd_addr_segs axi_bram_ctrl_0/S_AXI/Mem0]
assign_bd_address -offset 0x41200000 -range 64K -target_address_space [get_bd_addr_spaces processing_system7_0/Data] [get_bd_addr_segs axi_gpio_0/S_AXI/Reg]
assign_bd_address -offset 0x41210000 -range 64K -target_address_space [get_bd_addr_spaces processing_system7_0/Data] [get_bd_addr_segs axi_gpio_1/S_AXI/Reg]
assign_bd_address -offset 0x41600000 -range 64K -target_address_space [get_bd_addr_spaces processing_system7_0/Data] [get_bd_addr_segs axi_iic_0/S_AXI/Reg]
assign_bd_address -offset 0x42000000 -range 8K -target_address_space [get_bd_addr_spaces processing_system7_0/Data] [get_bd_addr_segs axi_bram_ctrl_1/S_AXI/Mem0]
assign_bd_address -offset 0x43C00000 -range 64K -target_address_space [get_bd_addr_spaces processing_system7_0/Data] [get_bd_addr_segs bluetooth_uart/S_AXI/Reg]
assign_bd_address -offset 0x43C10000 -range 64K -target_address_space [get_bd_addr_spaces processing_system7_0/Data] [get_bd_addr_segs minized_user_dsp_pic_0/minized_user_dsp_picos_s_axi/reg0]
assign_bd_address -offset 0x43C20000 -range 64K -target_address_space [get_bd_addr_spaces processing_system7_0/Data] [get_bd_addr_segs minizedtonedetect_0/minizedtonedetect_s_axi/reg0]
assign_bd_address -offset 0x43C30000 -range 64K -target_address_space [get_bd_addr_spaces processing_system7_0/Data] [get_bd_addr_segs axi_fifo_mm_s_0/S_AXI/Mem0]
assign_bd_address -offset 0x43C40000 -range 64K -target_address_space [get_bd_addr_spaces processing_system7_0/Data] [get_bd_addr_segs axi_fifo_mm_s_0/S_AXI_FULL/Mem1]
assign_bd_address -offset 0x44000000 -range 8K -target_address_space [get_bd_addr_spaces processing_system7_0/Data] [get_bd_addr_segs axi_bram_ctrl_2/S_AXI/Mem0]

validate_bd_design
save_bd_design
